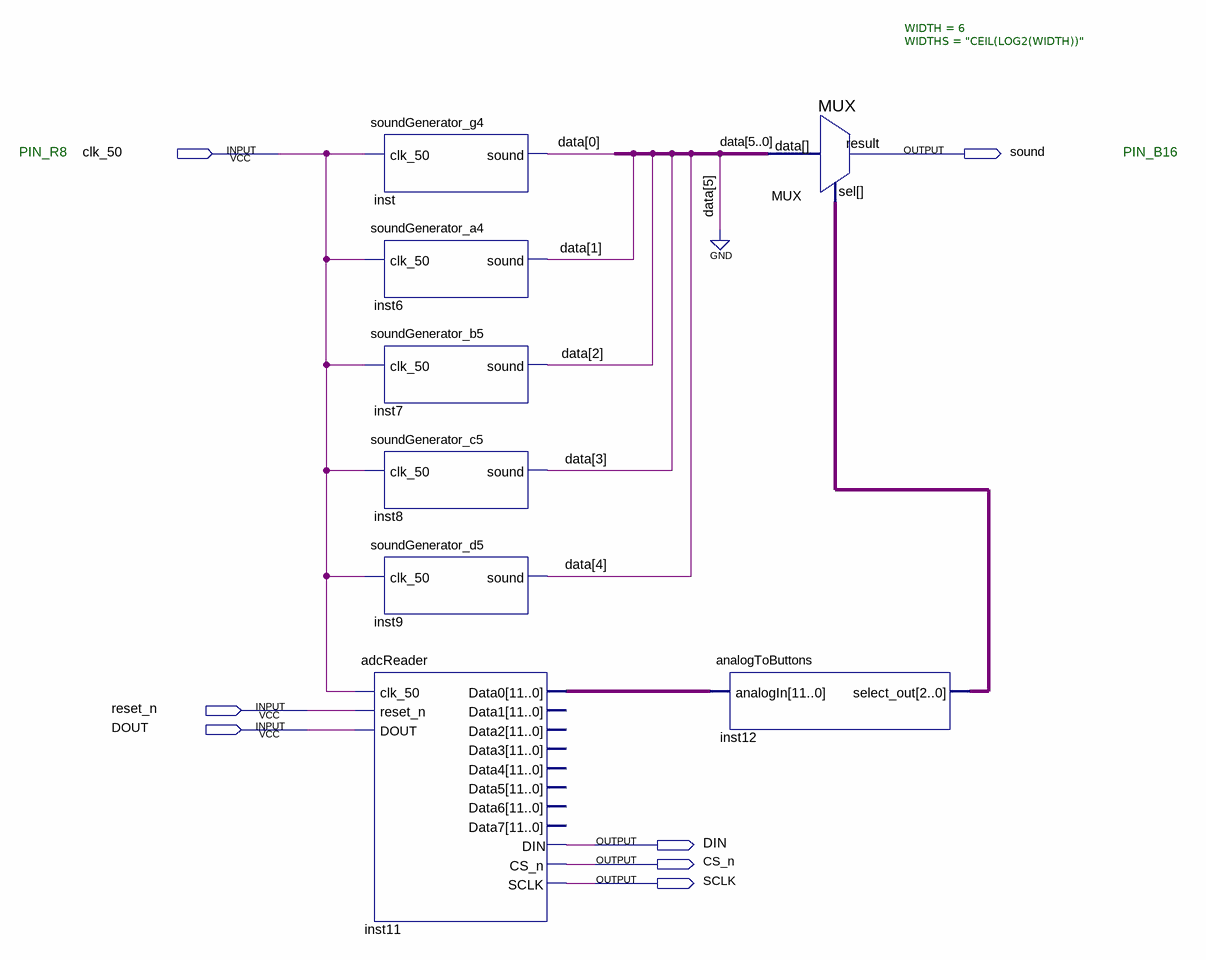
[diagram p0: schematic sheet]
// Quartus schematic Teil2.bdf as structural Verilog: 8 symbols, 7 pins
module Teil2 (
  input  clk_50,
  input  reset_n,
  input  DOUT,
  output sound,
  output DIN,
  output CS_n,
  output SCLK
);

  wire [2:0] inst12_select_out;
  wire [4:0] data;
  wire [11:0] inst11_data0;

  adcReader inst11 (
    .clk_50(clk_50), .reset_n(reset_n), .DOUT(DOUT), .Data0(inst11_data0), .DIN(DIN), .CS_n(CS_n), .SCLK(SCLK));  // open: Data1, Data2, Data3, Data4, Data5, Data6, Data7
  soundGenerator_g4 inst (.clk_50(clk_50), .sound(data[0]));
  soundGenerator_a4 inst6 (.clk_50(clk_50), .sound(data[1]));
  soundGenerator_b5 inst7 (.clk_50(clk_50), .sound(data[2]));
  soundGenerator_c5 inst8 (.clk_50(clk_50), .sound(data[3]));
  soundGenerator_d5 inst9 (.clk_50(clk_50), .sound(data[4]));
  analogToButtons inst12 (.analogIn(inst11_data0), .select_out(inst12_select_out));
  MUX #(.WIDTH(6), .WIDTHS("CEIL(LOG2(WIDTH))")) MUX (.data({1'b0, data}), .sel(inst12_select_out), .result(sound));

  // Notes on the sheet:
  //   PIN_R8
  //   PIN_B16
endmodule
